# EAGLE design EHDMIFPC01 (EAGLE 7.1.0)
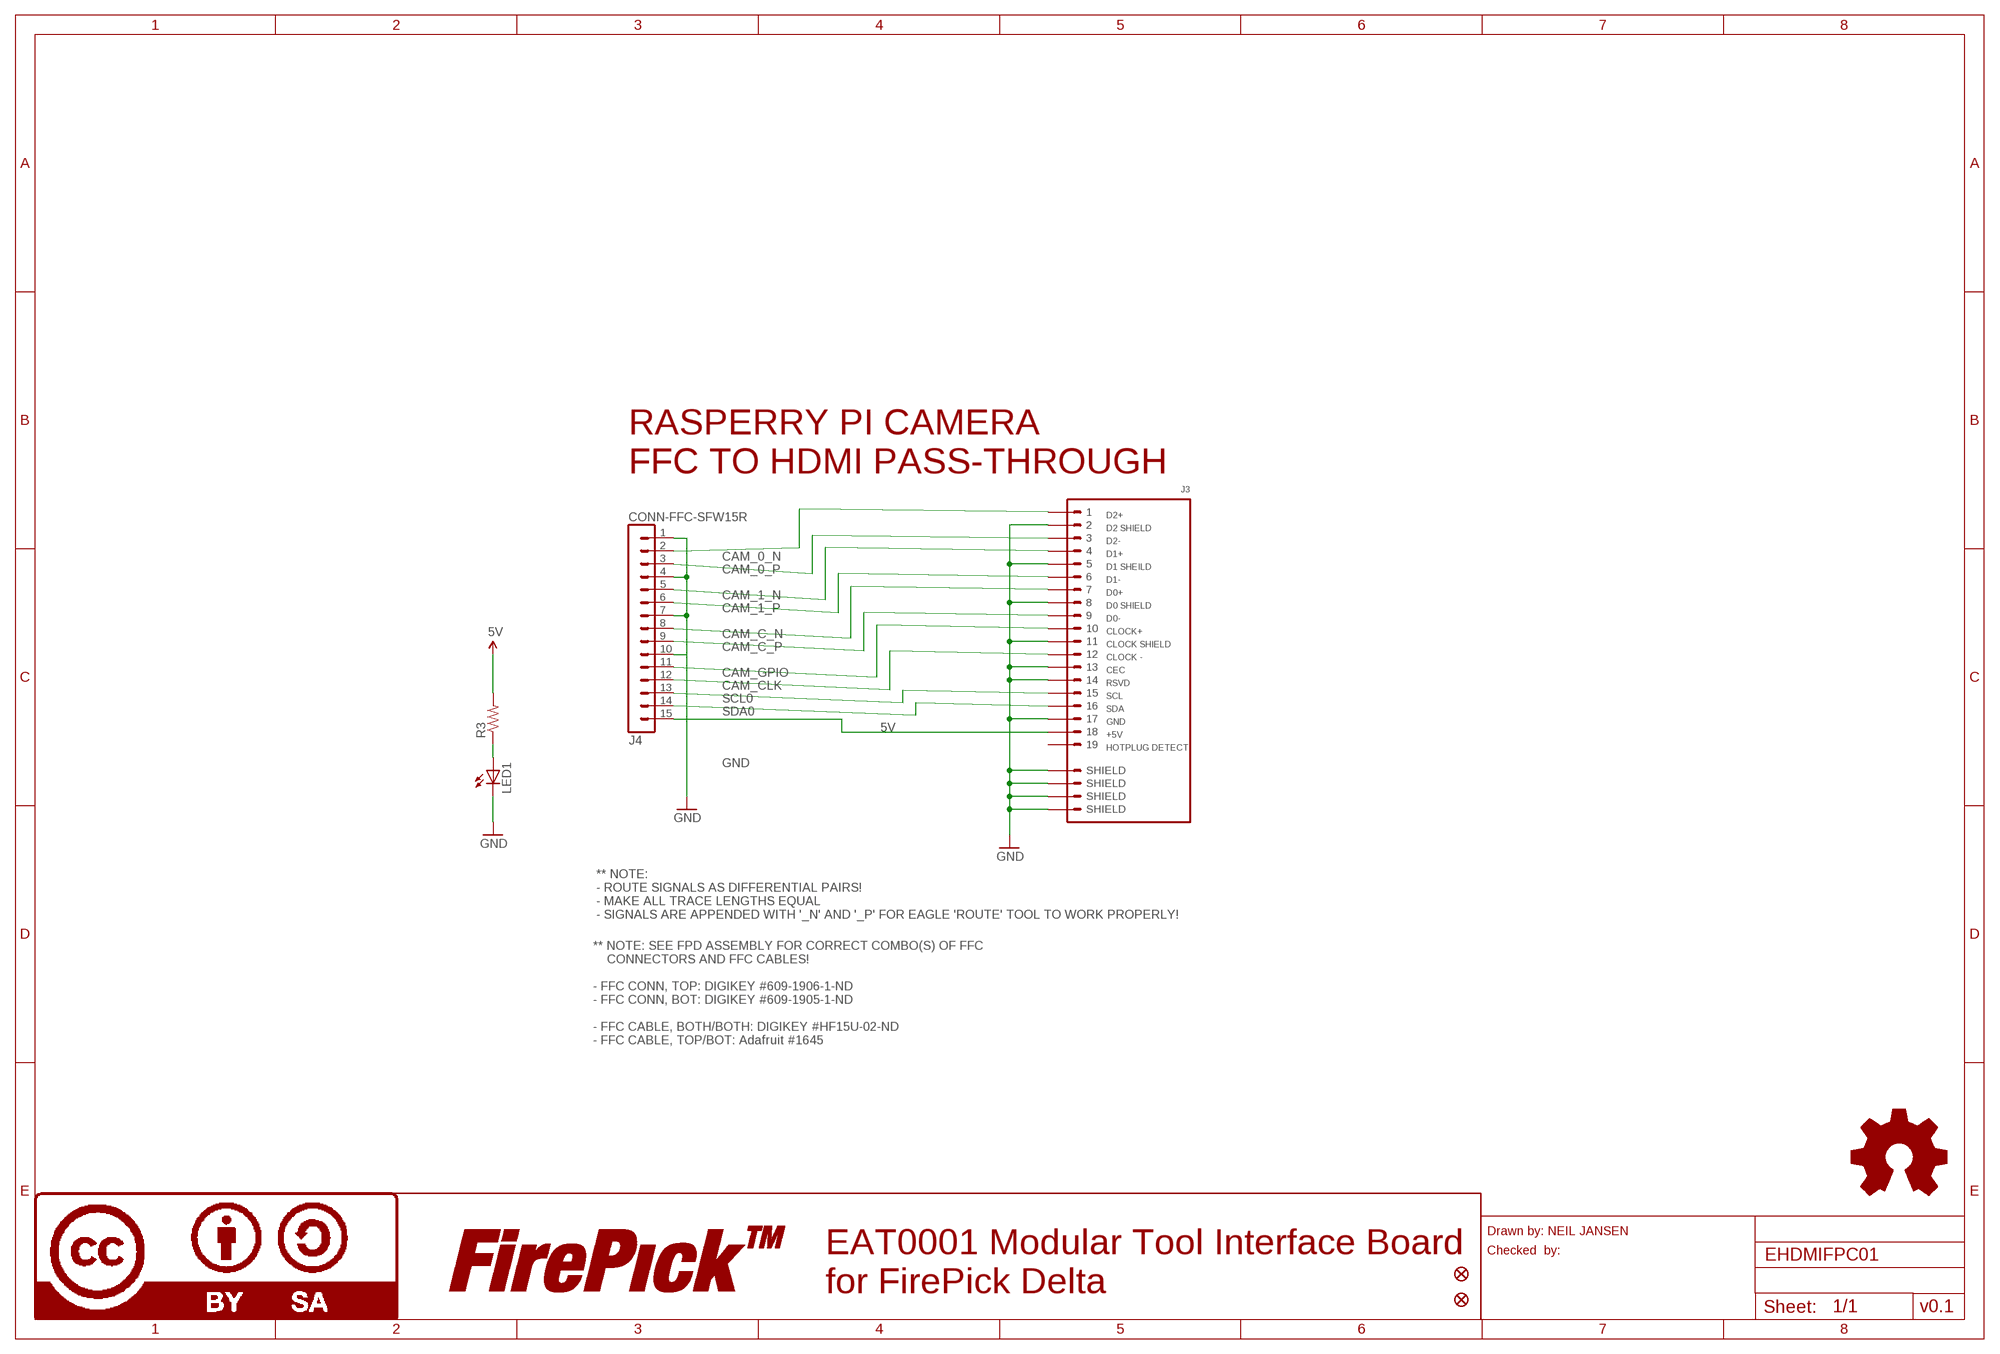
[diagram p0: schematic, sheet 1]

## Parts
FID3  FIDUCIAL1X2  [FIDUCIAL-1X2]
FID4  FIDUCIAL1X2  [FIDUCIAL-1X2]
J3  CONN-HDMI  [CON-HDMI-FCI-10029449-001RLF]
J4  CONN-FFC-SFW15R  [CON-FFC-SFW15R]
LED1  LED1206  [LED-1206]
LOGO4  LOGO-FIREPICKMEDIUM  [LOGO-FIREPICK-MEDIUM]
LOGO5  LOGO-OSHWSMALL  [LOGO-OSHW-SMALL]
LOGO6  LOGO-CC-BY-SAMEDIUM  [LOGO-CC-BY-SA-MEDIUM]
R3  RESISTOR0805-RES  [0805]

## Nets
5V: J3.18 J4.15 R3.2
CAM_0_N: J3.1 J4.2
CAM_0_P: J3.3 J4.3
CAM_1_N: J3.4 J4.5
CAM_1_P: J3.6 J4.6
CAM_C_N: J3.7 J4.8
CAM_C_P: J3.9 J4.9
CAM_GPIOCLK_N: J3.10 J4.11
CAM_GPIOCLK_P: J3.12 J4.12
CAM_SCLSDA_N: J3.15 J4.13
CAM_SCLSDA_P: J3.16 J4.14
GND: J3.2 J3.5 J3.8 J3.11 J3.13 J3.14 J3.17 J3.SHIELD1(SHIELD) J3.SHIELD2(SHIELD) J3.SHIELD3(SHIELD) J3.SHIELD4(SHIELD) J4.1 J4.4 J4.7 J4.10 LED1.C
N$3: LED1.A R3.1
Unconnected: J3.19

## Notes on the sheet
- RASPERRY PI CAMERA
  FFC TO HDMI PASS-THROUGH
- CAM_GPIO
- CAM_CLK
- SCL0
- SDA0
- ** NOTE:
  - ROUTE SIGNALS AS DIFFERENTIAL PAIRS!
  - MAKE ALL TRACE LENGTHS EQUAL
  - SIGNALS ARE APPENDED WITH '_N' AND '_P' FOR EAGLE 'ROUTE' TOOL TO WORK PROPERLY!
- ** NOTE: SEE FPD ASSEMBLY FOR CORRECT COMBO(S) OF FFC
      CONNECTORS AND FFC CABLES! 
  
  - FFC CONN, TOP: DIGIKEY #609-1906-1-ND
  - FFC CONN, BOT: DIGIKEY #609-1905-1-ND
  
  - FFC CABLE, BOTH/BOTH: DIGIKEY #HF15U-02-ND
  - FFC CABLE, TOP/BOT: Adafruit #1645
- Drawn by: NEIL JANSEN
- Checked  by:
- EAT0001 Modular Tool Interface Board
  for FirePick Delta
- v0.1

## Library data of the parts
FID3 FID4 = SparkFun-Aesthetics:FIDUCIAL: Fiducial Alignment Points Various fiducial points for machine vision alignment.
J3 = FirePick:CONN-HDMI
J4 = FirePick:CONN-FFC-SFW15R
LED1 = SparkFun-LED:LED: LEDs Standard schematic elements and footprints for 5mm, 3mm, 1206, and 0603 sized LEDs. 5mm - Spark Fun Electronics SKU : COM-00529 (and others)
LOGO4 = FirePick:LOGO-FIREPICK
LOGO5 = FirePick:LOGO-OSHW
LOGO6 = FirePick:LOGO-CC-BY-SA
R3 = SparkFun-Resistors:RESISTOR: Resistor Basic schematic elements and footprints for 0603, 1206, and PTH resistors.

## Board
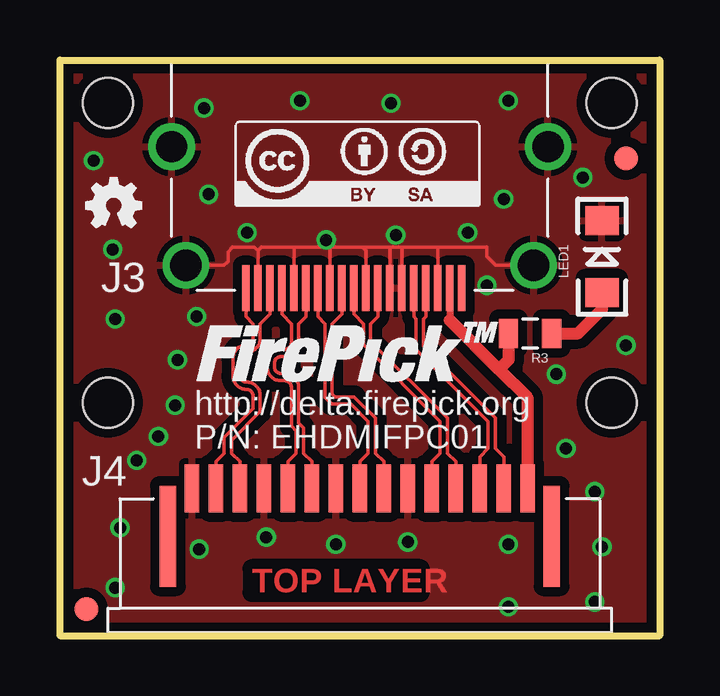
[diagram p1: board, top side]
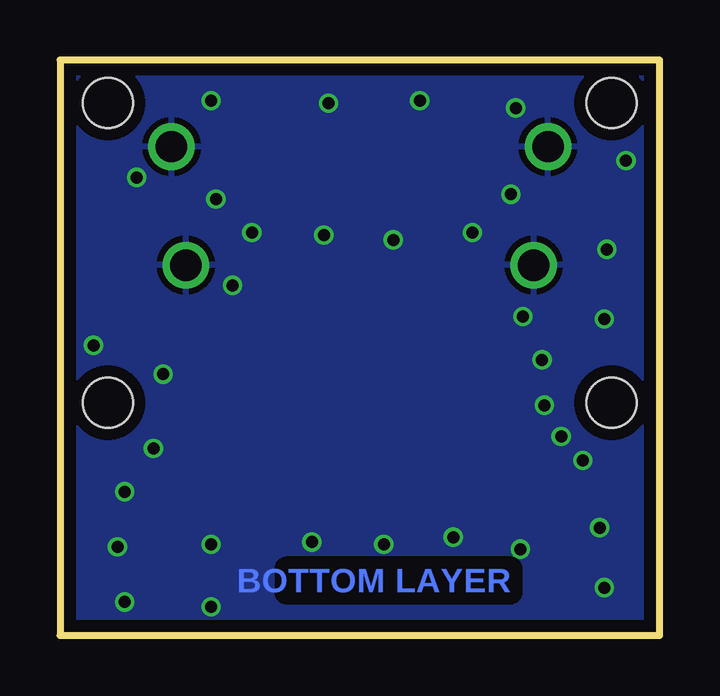
[diagram p2: board, bottom side, seen from below]

Size 25 x 24 mm. Coordinates in mm from the lower left corner, seen from the top.
Outline: 0,0 25,0 25,24 0,24 0,0
Copper layers (1*16): Top 0.035mm / dielectric 1.5mm / Bottom 0.035mm
Design rules "SeeedStudio_2layer_DRU_no_angle_20140221": minimum track width 6mil, minimum drill 12mil, track to track 6mil, track to pad 6mil, pad to pad 6mil, via to via 6mil, smd to smd 0mil, copper to edge 10mil, drill to drill 10mil, minimum pad ring 10mil, minimum via ring 6mil, stop-mask expansion 2mil, vias tented up to drill 100mil, thermal gap 10mil
Holes 2.1 mm at 2,22.21 23,22.21 2,9.71 23,9.71

### Footprints (pad centres in the part's own frame; a part is rotated, then mirrored left to right if it is on the bottom)
FIDUCIAL-1X2 = smd 1 x 1: 1 0,0
CON-HDMI-FCI-10029449-001RLF = smd 0.3 x 1.9: 1 4.75,3.81; 2 4.25,3.81; 3 3.75,3.81; 4 3.25,3.81; 5 2.75,3.81; 6 2.25,3.81; 7 1.75,3.81; 8 1.25,3.81; 9 0.75,3.81; 10 0.25,3.81; 11 -0.25,3.81; 12 -0.75,3.81; 13 -1.25,3.81; 14 -1.75,3.81; 15 -2.25,3.81; 16 -2.75,3.81; 17 -3.25,3.81; 18 -3.75,3.81; 19 -4.25,3.81 | drill 1.3: SHIELD1 -7.25,2.86; SHIELD2 -7.85,-2.09; SHIELD3 7.25,2.86; SHIELD4 7.85,-2.09
CON-FFC-SFW15R = smd 0.6 x 2: 1 -7,3.04; 2 -6,3.04; 3 -5,3.04; 4 -4,3.04; 5 -3,3.04; 6 -2,3.04; 7 -1,3.04; 8 0,3.04; 9 1,3.04; 10 2,3.04; 11 3,3.04; 12 4,3.04; 13 5,3.04; 14 6,3.04; 15 7,3.04 | smd 0.7 x 4.2: G1 -8,1.04; G2 8,1.04
LED-1206 = smd 1.2 x 1.4: A -1.5,0; C 1.5,0
0805 = smd 0.8 x 1.2: 1 -0.9,0; 2 0.9,0

### Placement (x,y rotation side)
FID3  1.1,1.1 0 top
FID4  23.6,19.9 0 top
J3  12.5,18.3 180 top
J4  12.5,3.1 0 top
LED1  22.6,15.8 90 top
LOGO4  5.7,10.6 0 top
LOGO5  1,16.8 0 top
LOGO6  7.3,17.9 0 top
R3  19.6,12.6 180 top

### Tracks (layer width: path | path; a pad name or v marks a point on that pad's centre or on a via)
5V
  Top 0.3: J3.18 16.25,13.15
  Top 0.5: J4.15 19.5,9.9 18.3,11.1 | 18.3,11.1 16.25,13.15 | R3.2 18.7,11.5 18.3,11.1
CAM_0_N
  Top 0.152: J3.1 7.75,13.3 8.05,13 8.05,12.39 arc-90 7.78,12.12 arc90 7.21,11.55 7.21,10.84 arc90 7.78,10.27 arc-90 8.05,10 8.05,9.46 6.85,8.26 6.85,7.6 6.5,7.25 J4.2
CAM_0_P
  Top 0.152: J3.3 8.75,13.4 8.35,13 8.35,12.39 arc-90 7.78,11.81 arc90 7.51,11.55 7.51,10.84 arc90 7.78,10.57 arc-90 8.35,10 8.35,9.34 7.15,8.14 7.15,7.6 7.5,7.25 J4.3
CAM_1_N
  Top 0.152: J3.4 9.25,13.4 9.65,13 9.65,12.2 arc-90 9.38,11.93 9.21,11.93 arc90 8.64,11.36 8.64,11.2 arc90 9.21,10.63 9.38,10.63 arc-90 9.65,10.36 9.65,8.74 9.85,8.54 9.85,7.6 9.5,7.25 J4.5
CAM_1_P
  Top 0.152: J3.6 10.25,13.3 9.95,13 9.95,12.2 arc-90 9.38,11.63 9.21,11.63 arc90 8.94,11.36 8.94,11.2 arc90 9.21,10.93 9.38,10.93 arc-90 9.95,10.36 9.95,8.86 10.15,8.66 10.15,7.6 10.5,7.25 J4.6
CAM_C_N
  Top 0.152: J4.8 12.5,7.25 12.85,7.6 12.85,8.94 12.14,9.65 11.34,9.65 11.05,9.94 11.05,13 10.75,13.3 J3.7
CAM_C_P
  Top 0.152: J4.9 13.5,7.25 13.15,7.6 13.15,9.06 12.26,9.95 11.46,9.95 11.35,10.06 11.35,13 11.75,13.4 J3.9
CAM_GPIOCLK_N
  Top 0.152: J3.10 12.25,13.4 12.65,13 12.65,12.14 15.85,8.94 15.85,7.6 15.5,7.25 J4.11
CAM_GPIOCLK_P
  Top 0.152: J3.12 13.25,13.3 12.95,13 12.95,12.26 16.15,9.06 16.15,7.6 16.5,7.25 J4.12
CAM_SCLSDA_N
  Top 0.152: J3.15 14.75,13.3 14.85,13.2 14.85,11.94 17.85,8.94 17.85,7.8 17.5,7.45 J4.13
CAM_SCLSDA_P
  Top 0.152: J3.16 15.25,13.3 15.15,13.2 15.15,12.06 18.15,9.06 18.15,7.8 18.5,7.45 J4.14
GND  (via drill 0.5)
  Top 0.152: J3.2 8.25,16.05 | 8.25,16.05 8.4,16.2 9.8,16.2 | 9.8,16.2 11.2,16.2 | 11.2,16.2 12.6,16.2 | 12.6,16.2 13.8,16.2 | 13.8,16.2 14.2,16.2 | 14.2,16.2 15.8,16.2 | J3.17 15.75,16.15 15.8,16.2 | J3.14 14.25,16.15 14.2,16.2 | J3.13 13.75,16.15 13.8,16.2 | J3.11 12.75,16.05 12.6,16.2 | J3.8 11.25,16.15 11.2,16.2 | J3.5 9.75,16.15 9.8,16.2 | J3.SHIELD3 6.84,15.44 7,15.6 7,16 7.2,16.2 8.1,16.2 8.25,16.05 | J3.SHIELD1 18.16,15.44 17.8,15.8 17.8,16.2 15.8,16.2
  other vias: 5.8,3.6 11.5,3.8 14.5,3.9 18.7,1.2 22.3,1.4 22.6,3.7 22.3,6 2.3,2 3.2,7.3 4.1,8.3 4.9,11.5 2.5,4.5 1.4,19.8 2.2,16.1 7.8,16.8 6,22 6.2,18.4 13.8,22.2 18.7,22.3 17.8,14.6 20.7,10.9 21.1,7.8 23.6,12.1 18.5,18.2 17,16.8 14,16.7 11.1,16.5 10,22.3 21.8,19.1 18.7,3.8 2.3,13.2 8.6,4.1 4.8,9.6 5.7,13.3
  pour Bottom (isolate 0.5): 0,23.9 25,24 25,0 0,-0.1
  pour Top (isolate 0.4): 0,24 25,24 25,0 0,0
N$3
  Top 0.5: LED1.A 22.6,13.6 21.6,12.6 R3.1

### Text on the board
Top: TOP LAYER
Bottom: BOTTOM LAYER
tPlace: http://delta.firepick.org | P/N: EHDMIFPC01